# Altium schematic sheet AMS_Control.SchDoc: Control Circuit 1
size A4; CheckedBy: Àlex Sánchez i Benet; DrawnBy: Àlex Sánchez i Benet; DocumentNumber: 1; Revision: 1; SheetNumber: 3; SheetTotal: 5; University: UPC EEBE; City: Barcelona; Country: Spain; CP: 08019; Address: Av. Eduard Maristany, 16
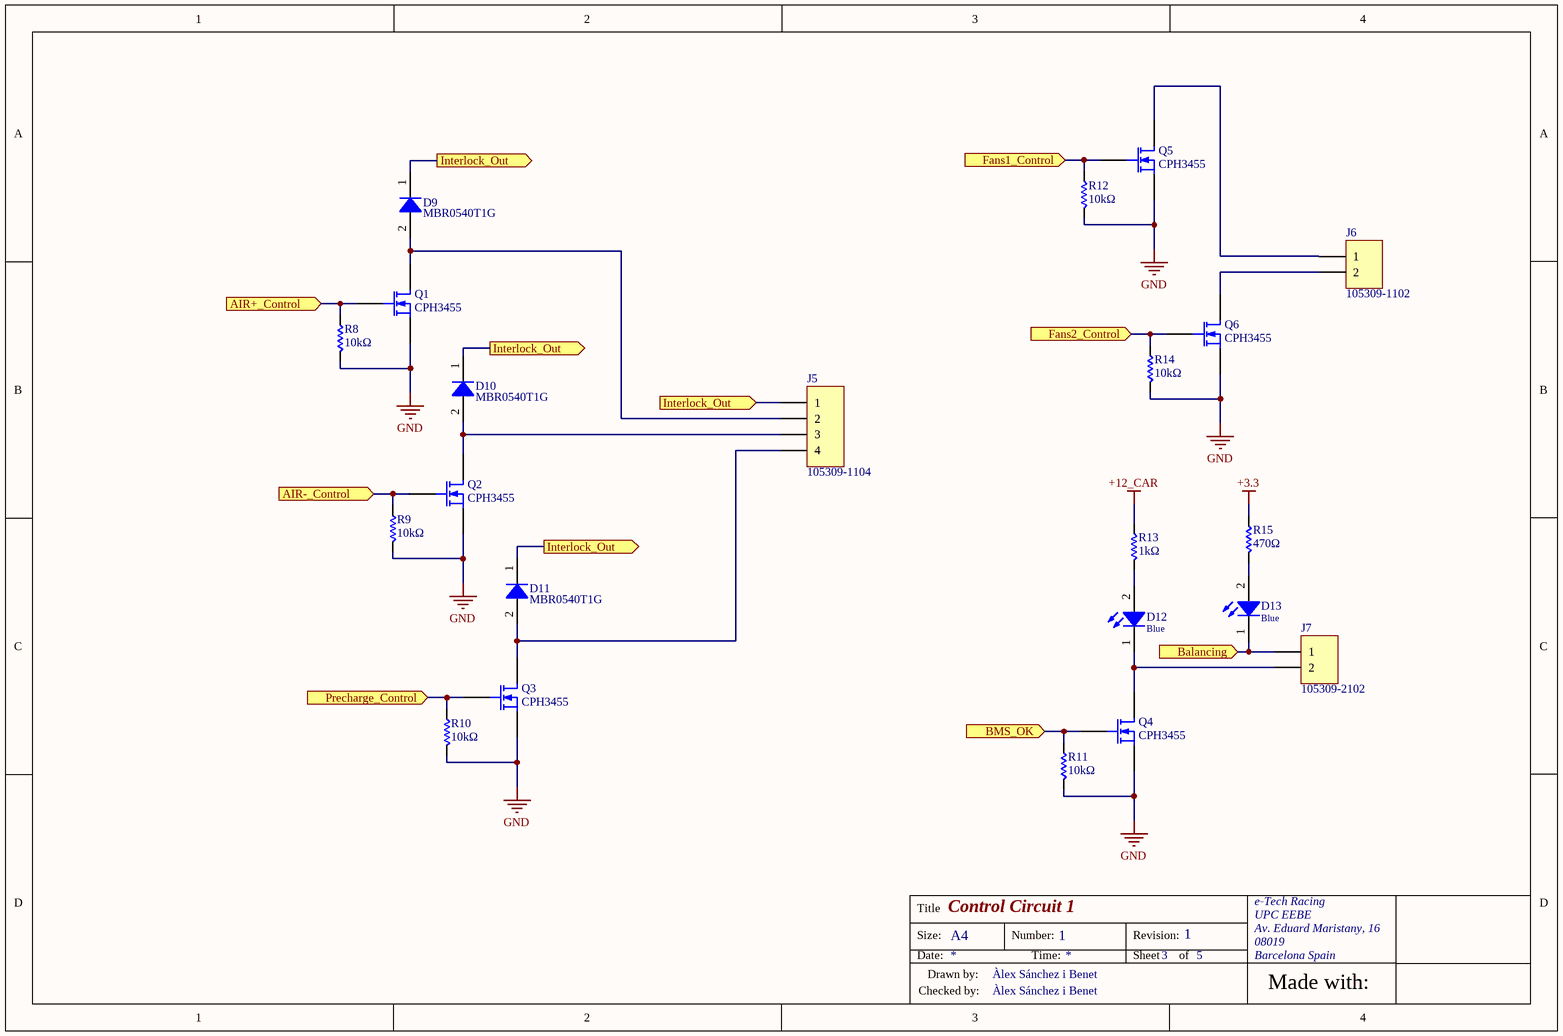
[diagram p0: AMS_Control.SchDoc]

## Parts
D9  MBR0540T1G  [MBR0540T1G]
D10  MBR0540T1G  [MBR0540T1G]
D11  MBR0540T1G  [MBR0540T1G]
D12  Blue  [WL-SMCW_0805]
D13  Blue  [WL-SMCW_0805]
J5  105309-1104  [105309-1104]
J6  105309-1102  [105309-1102]
J7  105309-2102  [105309-2102]
Q1  CPH3455  [CPH3455]
Q2  CPH3455  [CPH3455]
Q3  CPH3455  [CPH3455]
Q4  CPH3455  [CPH3455]
Q5  CPH3455  [CPH3455]
Q6  CPH3455  [CPH3455]
R8  10kΩ  [CR0805]
R9  10kΩ  [CR0805]
R10  10kΩ  [CR0805]
R11  10kΩ  [CR0805]
R12  10kΩ  [CR0805]
R13  1kΩ  [CR0805]
R14  10kΩ  [CR0805]
R15  470Ω  [CR0805]

## Ports
AIR+_Control (in), AIR-_Control (in), Balancing (in), BMS_OK (in), Fans1_Control (in), Fans2_Control (in), Interlock_Out (in), Interlock_Out (out), Precharge_Control (in)

## Nets
+3.3: R15.2
+12_CAR: R13.2
GND: Q1.2(S) Q2.2(S) Q3.2(S) Q4.2(S) Q5.2(S) Q6.2(S) R8.1 R9.1 R10.1 R11.1 R12.1 R14.1
AIR+_Control: Q1.1(G) R8.2 ; port AIR+_Control
AIR-_Control: Q2.1(G) R9.2 ; port AIR-_Control
Balancing: D13.1(K) J7.1 ; port Balancing
BMS_OK: Q4.1(G) R11.2 ; port BMS_OK
Fans1_Control: Q5.1(G) R12.2 ; port Fans1_Control
Fans2_Control: Q6.1(G) R14.2 ; port Fans2_Control
Interlock_Out: D9.1(K) D10.1(K) D11.1(K) J5.1 ; port Interlock_Out
Precharge_Control: Q3.1(G) R10.2 ; port Precharge_Control
NetD9_2: D9.2(A) J5.2 Q1.3(D)
NetD10_2: D10.2(A) J5.3 Q2.3(D)
NetD11_2: D11.2(A) J5.4 Q3.3(D)
NetD12_1: D12.1(K) J7.2 Q4.3(D)
NetD12_2: D12.2(A) R13.1
NetD13_2: D13.2(A) R15.1
NetJ6_1: J6.1 Q5.3(D)
NetJ6_2: J6.2 Q6.3(D)

## Notes on the sheet
- Title
- e-Tech Racing
- UPC EEBE
- Size:
- Date:
- Drawn by:
- A4
- Number:
- Time:
- Revision:
- Sheet
- of
- Av. Eduard Maristany, 16
- 08019
- Barcelona Spain
- Made with:
- Checked by:

## Library data of the parts
D9-D11 = MBR0540T1G: Surface Mount Schottky Power Rectifier; Manufacturer: On Semiconductor; ComponentLink1Description: Datasheet; ComponentLink1URL: https://www.onsemi.com/pub/Collateral/MBR0540T1-D.PDF
D12 D13 = 150080BS75000: SMT Mono-color Chip LED Waterclear WL-SMCW, size 0805, Blue, 3.2 V, 140 deg, 145 mcd; Forward Voltage: 3.2 V; Viewing Angle: 140 deg; Peak Wavelength: 465 nm; Dominant Wavelength: 470 nm; Luminous Intensity: 145 mcd; Chip Technology: InGaN; ComponentLink1Description: Manufacturer; ComponentLink1URL: http://www.we-online.de; ComponentLink2Description: Datasheet; ComponentLink2URL: https://katalog.we-online.de/led/datasheet/150080BS75000.pdf; Part Number: 150080BS75000; Published Date: November 2018; Publisher: Wurth Elektronik; Size: 0805; Operating Temperature: -40 to 85 degC; Emitting Color: Blue; Mounting Technology: SMT; Packaging: Tape and Reel
J5 = 105309-1104: Nano-Fit Vertical Header, Through Hole, 2.50mm Pitch, Single Row, 4 Circuits, Black; Manufacturer: Molex; Rated Voltage: 250V DC; Rated Current: 6.5A; Operating Temperature: -40° to +105°C; ComponentLink1Description: Datasheet; ComponentLink1URL: https://www.molex.com/webdocs/datasheets/pdf/en-us/1053091104_PCB_HEADERS.pdf
J6 = 105309-1102: Nano-Fit Vertical Header, Through Hole, 2.50mm Pitch, Single Row, 2 Circuits, Black; Manufacturer: Molex; Rated Voltage: 250V DC; Rated Current: 6.5A; Operating Temperature: -40° to +105°C; ComponentLink1Description: Datahsheet; ComponentLink1URL: https://www.molex.com/webdocs/datasheets/pdf/en-us/1053091103_PCB_HEADERS.pdf
J7 = 105309-2102: Nano-Fit Vertical Header, Through Hole, 2.50mm Pitch, Single Row, 2 Circuits, Natural; Manufacturer: Molex; Rated Voltage: 250V DC; Rated Current: 6.5A; Operating Temperature: -40° to +105°C; ComponentLink1Description: Datasheet; ComponentLink1URL: https://www.molex.com/webdocs/datasheets/pdf/en-us/1053092102_PCB_HEADERS.pdf
Q1-Q6 = CPH3455: Power MOSFET 35V, 104mΩ, 3A, Single N-Channel; Manufacturer: ON Semiconductors; ComponentLink1Description: Datasheet; ComponentLink1URL: https://www.onsemi.com/pub/Collateral/CPH3455-D.PDF
R8-R14 = CR0805-JW-103ELF: Chip Resistor 0805; Manufacturer: Bourns; ComponentLink1Description: Datasheet; ComponentLink1URL: https://www.bourns.com/docs/product-datasheets/chpreztr.pdf?sfvrsn=566c91f1_11
R15 = CR0805-FX-4700GLF: Chip Resistor 0805; Manufacturer: Bourns; ComponentLink1Description: Datasheet; ComponentLink1URL: https://www.bourns.com/docs/product-datasheets/chpreztr.pdf?sfvrsn=566c91f1_11